# EAGLE design base01 (EAGLE 6.5.0)
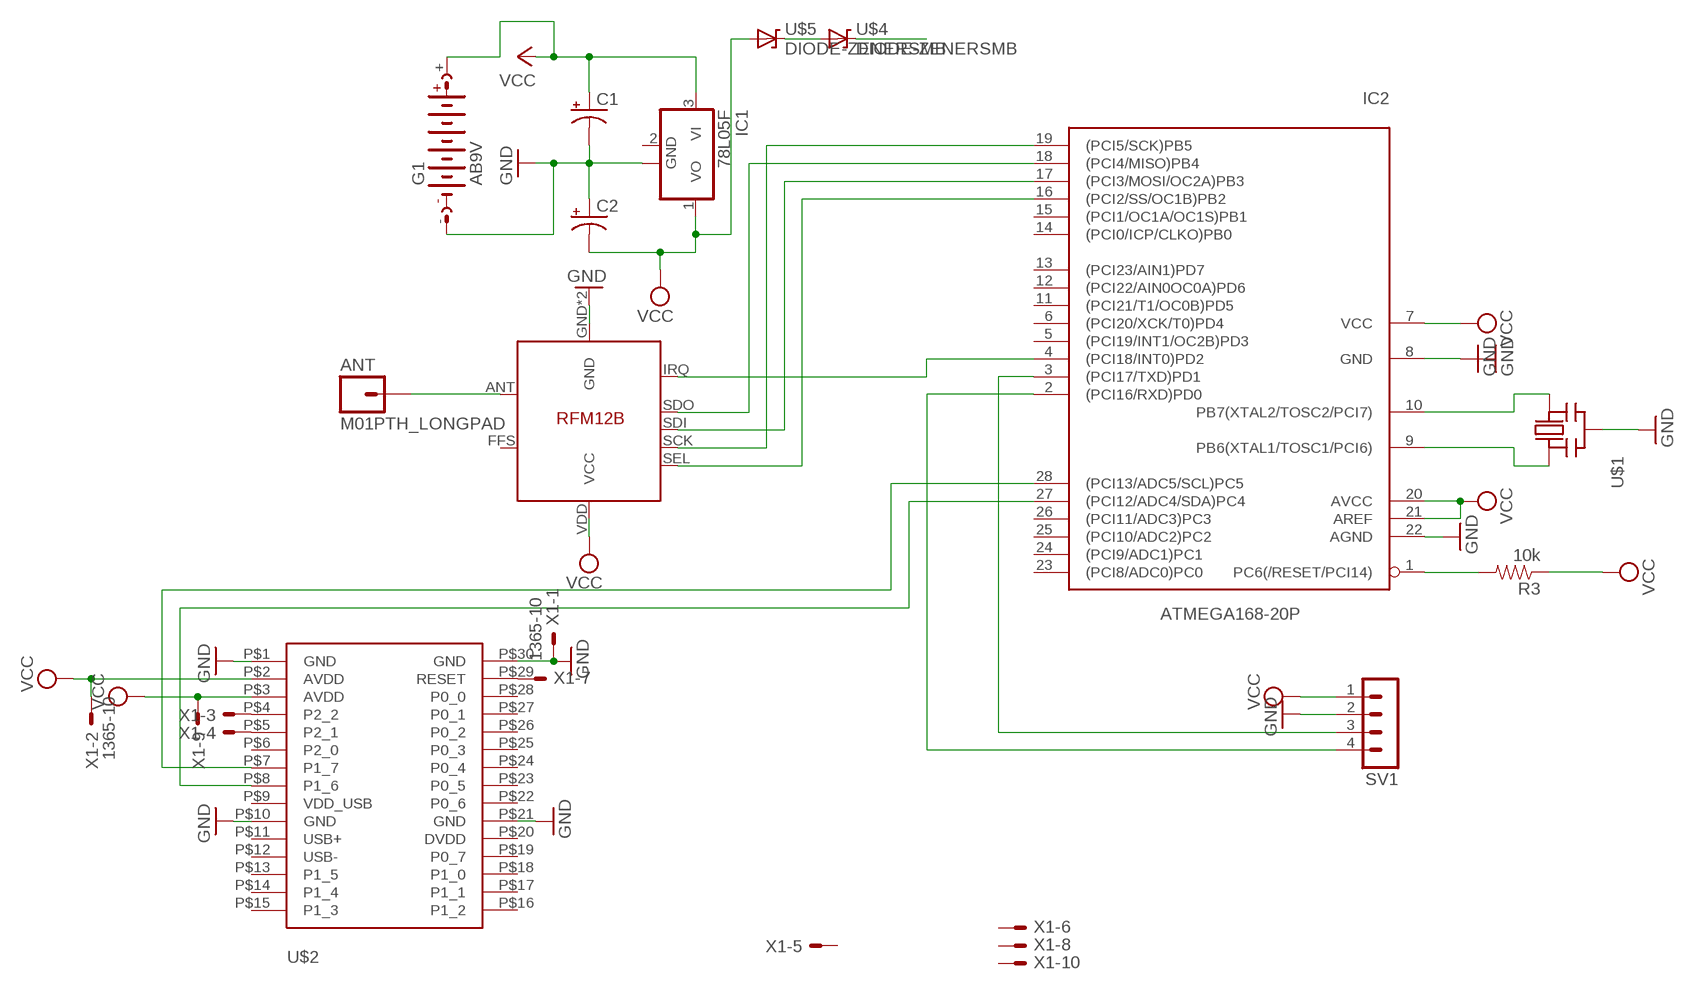
[diagram p0: schematic, sheet 1]

## Parts
ANT  M01PTH_LONGPAD  [1X01_LONGPAD]
C1  CAP_POLC  [PANASONIC_C]
C2  CAP_POLC  [PANASONIC_C]
G1  AB9V  [AB9V]
IC1  78L05F  [SOT89]
IC2  ATMEGA168-20P  [DIL28-3]
R3  10k  RESISTOR2512  [R2512]
SV1  MA04-1  [MA04-1]
U$1  CERMOSCILL-CSTCRG  [CSTCR-G]
U$2  BLE112  [BLE112]
U$3  RFM12BRMF12BGND  [RFM12B]
U$4  DIODE-ZENERSMB  [SMB-DIODE]
U$5  DIODE-ZENERSMB  [SMB-DIODE]
X1  1365-10  [1365-10]

## Nets
GND: C1.- C2.+ G1.- IC1.2@1(GND) IC2.8(GND) IC2.22(AGND) SV1.2 U$1.2(GND) U$2.P$1(GND) U$2.P$10(GND) U$2.P$21(GND) U$2.P$30(GND) U$3.GND U$3.P$12(GND) X1.1
N$1: IC2.28((PCI13/ADC5/SCL)PC5) U$2.P$7(P1_7)
N$2: IC2.9(PB6(XTAL1/TOSC1/PCI6)) U$1.1(IN)
N$3: IC2.4((PCI18/INT0)PD2) U$3.IRQ
N$4: IC2.16((PCI2/SS/OC1B)PB2) U$3.SEL
N$5: IC2.19((PCI5/SCK)PB5) U$3.SCK
N$6: IC2.17((PCI3/MOSI/OC2A)PB3) U$3.SDI
N$7: IC2.3((PCI17/TXD)PD1) SV1.3
N$8: IC2.27((PCI12/ADC4/SDA)PC4) U$2.P$8(P1_6)
N$9: U$2.P$29(RESET) X1.7
N$10: IC2.2((PCI16/RXD)PD0) SV1.4
N$11: U$2.P$4(P2_2) X1.3
N$12: U$2.P$5(P2_1) X1.4
N$13: IC2.10(PB7(XTAL2/TOSC2/PCI7)) U$1.3(OUT)
N$14: IC2.18((PCI4/MISO)PB4) U$3.SDO
N$15: U$4.A U$5.C
N$16: ANT.1 U$3.ANT
N$30: IC2.1(PC6(/RESET/PCI14)) R3.2
VCC: U$2.P$3(AVDD) X1.9
VCC3V: U$2.P$2(AVDD) U$4.C X1.2 ; supply symbol labelled VCC
VCC5V: C2.- IC1.1(VO) IC2.7(VCC) IC2.20(AVCC) IC2.21(AREF) R3.1 SV1.1 U$3.VDD(VCC) U$5.A ; supply symbol labelled VCC
VCCBAT: C1.+ G1.+ IC1.3(VI) ; supply symbol labelled VCC
Unconnected: IC1.2(GND) IC2.5((PCI19/INT1/OC2B)PD3) IC2.6((PCI20/XCK/T0)PD4) IC2.11((PCI21/T1/OC0B)PD5) IC2.12((PCI22/AIN0OC0A)PD6) IC2.13((PCI23/AIN1)PD7) IC2.14((PCI0/ICP/CLKO)PB0) IC2.15((PCI1/OC1A/OC1S)PB1) IC2.23((PCI8/ADC0)PC0) IC2.24((PCI9/ADC1)PC1) IC2.25((PCI10/ADC2)PC2) IC2.26((PCI11/ADC3)PC3) U$2.P$6(P2_0) U$2.P$9(VDD_USB) U$2.P$11(USB+) U$2.P$12(USB-) U$2.P$13(P1_5) U$2.P$14(P1_4) U$2.P$15(P1_3) U$2.P$16(P1_2) U$2.P$17(P1_1) U$2.P$18(P1_0) U$2.P$19(P0_7) U$2.P$20(DVDD) U$2.P$22(P0_6) U$2.P$23(P0_5) U$2.P$24(P0_4) U$2.P$25(P0_3) U$2.P$26(P0_2) U$2.P$27(P0_1) U$2.P$28(P0_0) U$3.FFS X1.5 X1.6 X1.8 X1.10

## Library data of the parts
ANT = SparkFun:M01: Header 1 Standard 1-pin 0.1" header. Use with straight break away headers (SKU : PRT-00116), right angle break away headers (PRT-00553), swiss pins (PRT-00743), machine pins (PRT-00117), and female headers (PRT-00115).
C1 C2 = SparkFun:CAP_POL: Capacitor Polarized These are standard SMD and PTH capacitors. Normally 10uF, 47uF, and 100uF in electrolytic and tantalum varieties. Always verify the external diameter of the through hole cap, it varies with capacity, voltage, and manufacturer. The EIA devices should be standard.
G1 = battery:AB9V: 9-V BATTERY CLIP
IC1 = linear:78L*: POSITOIV-VOLTAGE REGULATORS Output up to 100 mA Source: http://focus.ti.com/lit/ds/symlink/ua78l05.pdf
IC2 = adafruit:ATMEGA168*P: MICROCONTROLLER 16 kBytes FLASH 1 kBytes SRAM 512 Bytes EEPROM USART 8-channel 10 bit ADC
R3 = SparkFun:RESISTOR: Resistor Basic schematic elements and footprints for 0603, 1206, and PTH resistors.
SV1 = con-lstb:MA04-1: PIN HEADER; OC_FARNELL: unknown; OC_NEWARK: unknown
U$1 = adafruit:CERMOSCILL: Ceramic oscillator with built in capacitors such as ZTT-12MHz http://www.ladyada.net/library/eagle
U$2 = lightsuits:BLE112
U$3 = JeeParts:RFM12B: GND pins connected
U$4 U$5 = SparkFun:DIODE-ZENER: Zener Diode Production Part - 8199 3.4V Zener Voltage
X1 = con-leotronics:1365-10: DUAL ROW STRAIGHT HEADER 1364 SERIES. 1.27mm x 1.27mm. Without Fixing Post. SMT Source: http://www.leotronics.co.uk/Conexcon/Data%20Sheets/sec.%20A/1364ing.pdf; OC_FARNELL: unknown; OC_NEWARK: unknown

## Board
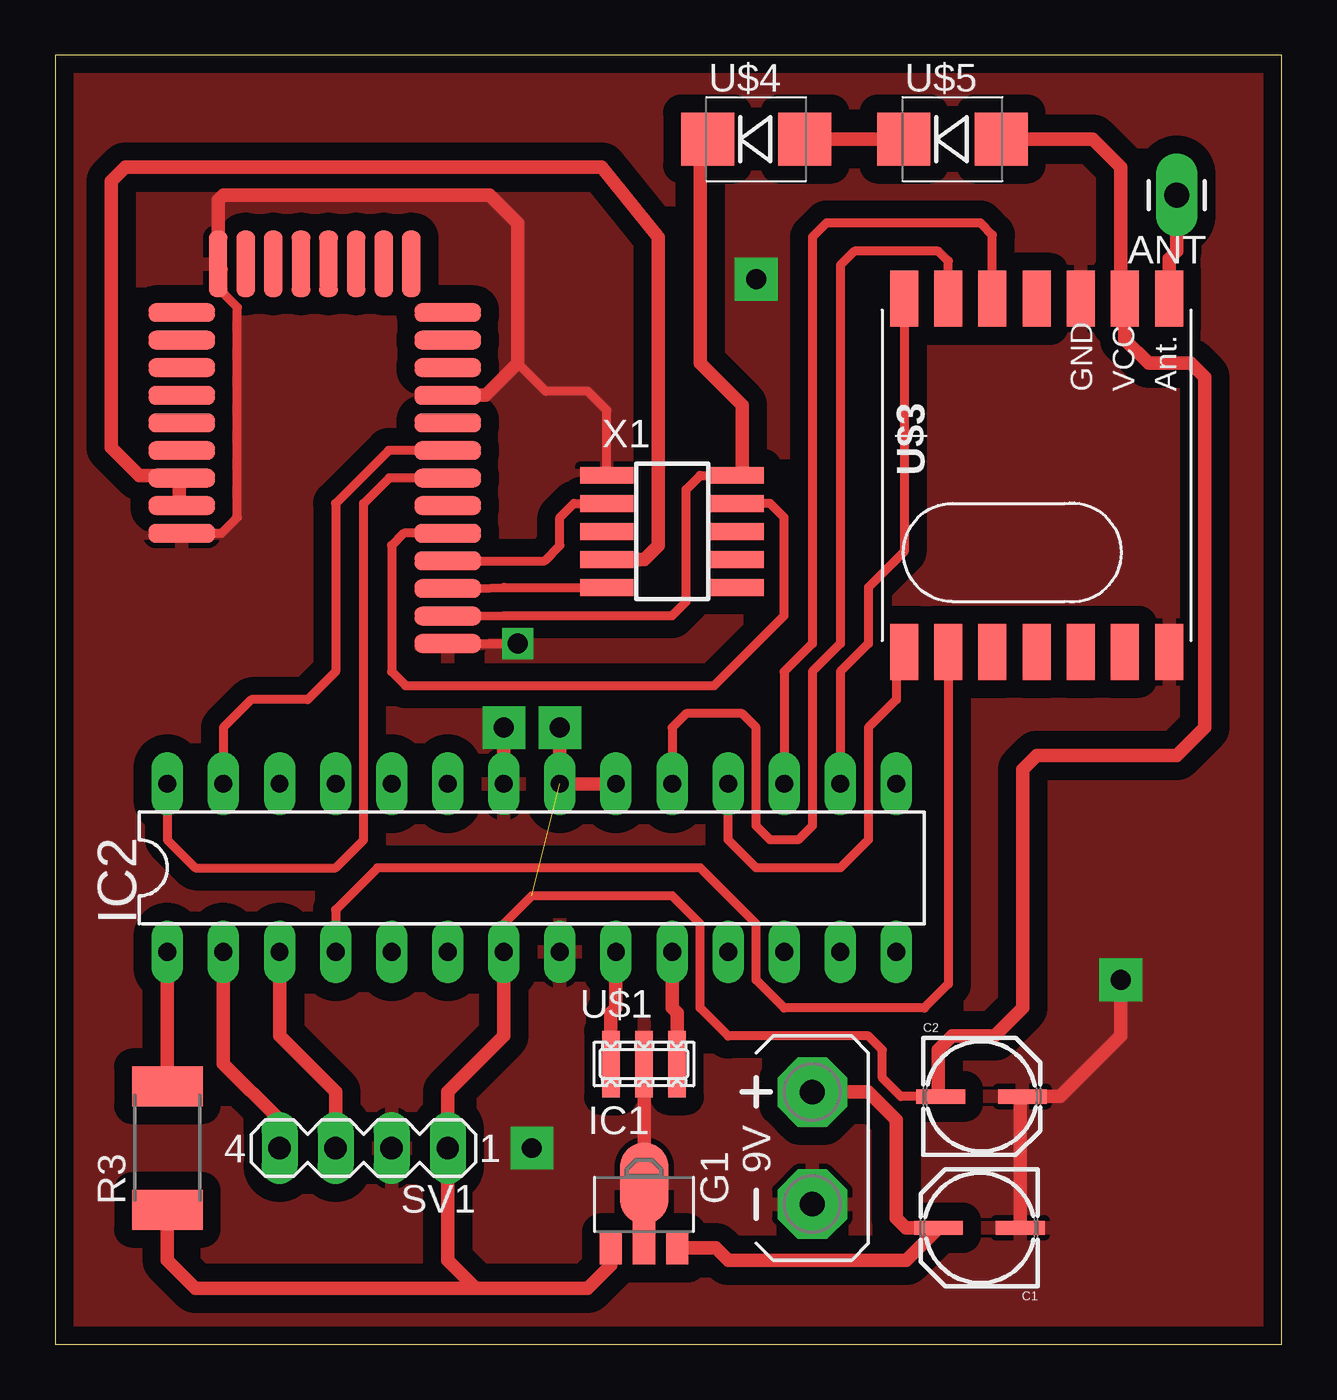
[diagram p1: board, top side]
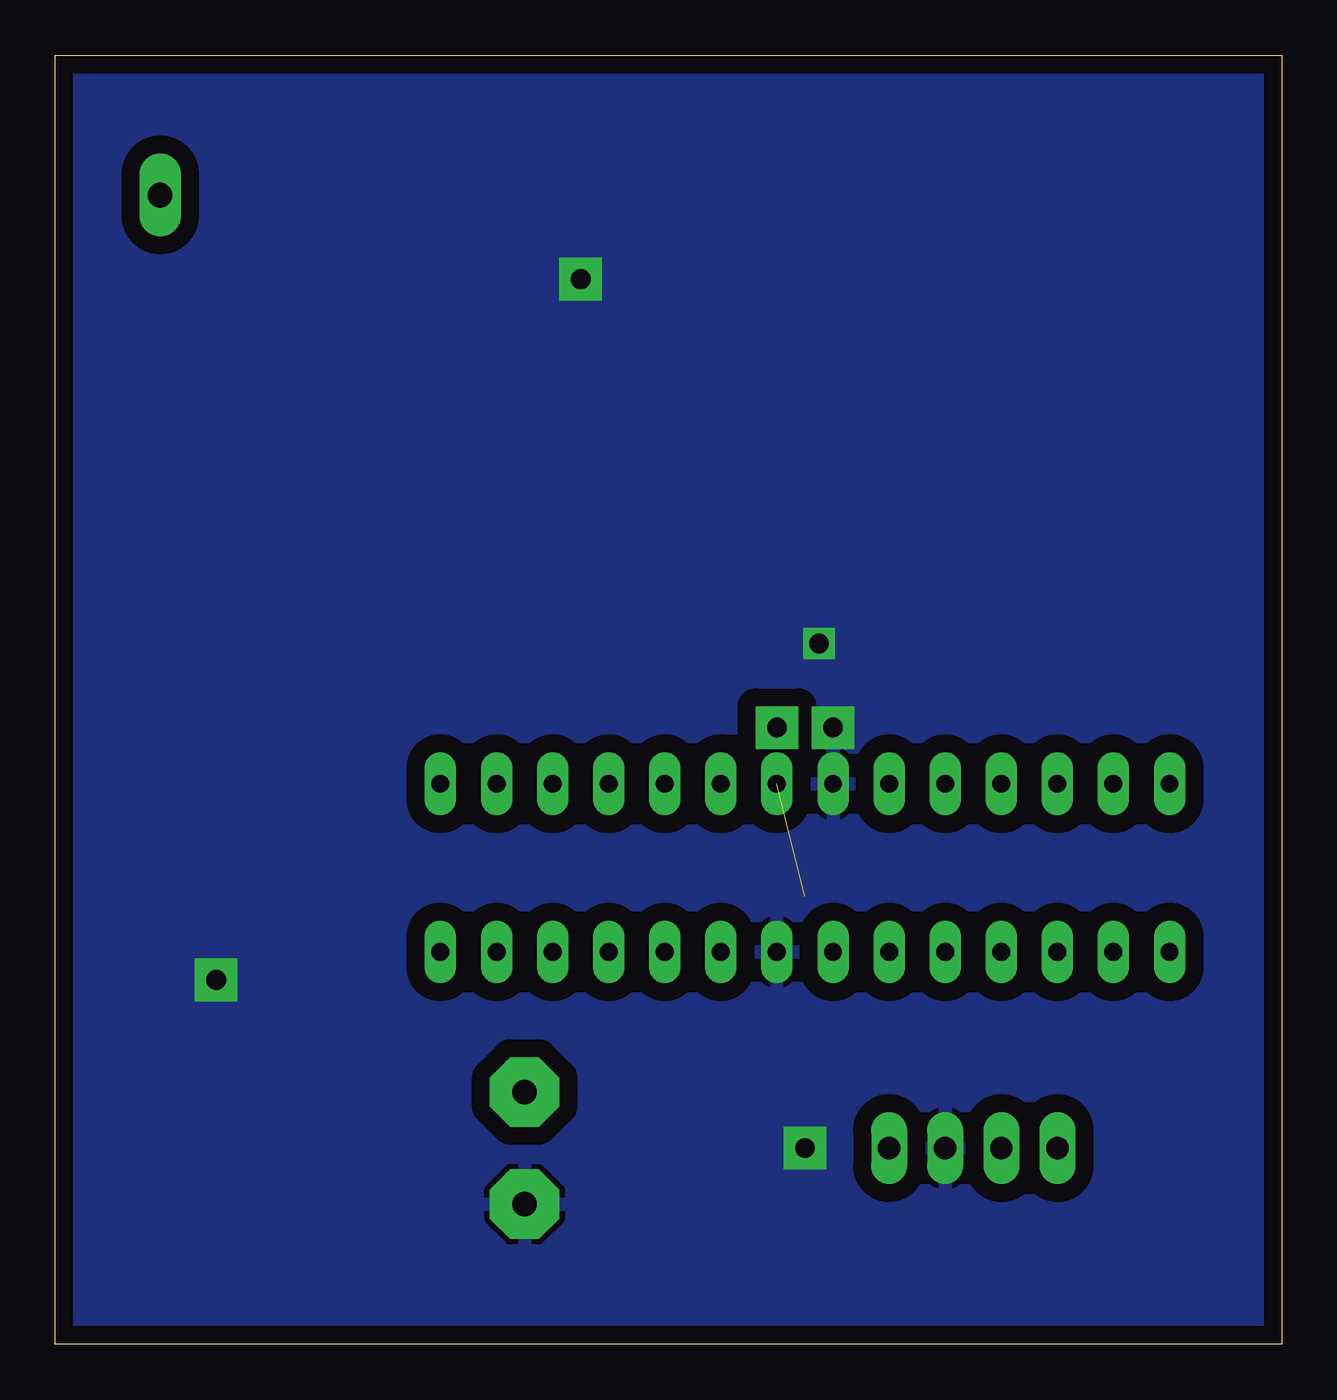
[diagram p2: board, bottom side, seen from below]

Size 55.55 x 58.41 mm. Coordinates in mm from the lower left corner, seen from the top.
Outline: 0,0 55.55,0 55.55,58.41 0,58.41 0,0
Copper layers (1*16): Top 0.035mm / dielectric 1.5mm / Bottom 0.035mm
Design rules "SparkFun": minimum track width 8mil, minimum drill 20mil, track to track 8mil, track to pad 8mil, pad to pad 8mil, via to via 8mil, smd to smd 8mil, copper to edge 10mil, drill to drill 8mil, minimum pad ring 12mil, minimum via ring 10mil, stop-mask expansion 4mil, vias tented up to drill 25mil, thermal gap 10mil

### Footprints (pad centres in the part's own frame; a part is rotated, then mirrored left to right if it is on the bottom)
1X01_LONGPAD = drill 1.118 pad 1.88 long: 1 0,0
PANASONIC_C = smd 2.2 x 0.65: + 1.9,-0.2; - -1.8,-0.2
AB9V = drill 1.118 pad 3.15 octagon: + 0,2.54; - 0,-2.54
SOT89 = smd 1 x 1.5: 1 -1.499,-1.981; 3 1.499,-1.981 | smd 1 x 2: 2 0,-1.727 | smd 2.2 x 3.7: 2@1 0,0.94
DIL28-3 = drill 0.813 long: 1 -16.51,-3.81; 2 -13.97,-3.81; 3 -11.43,-3.81; 4 -8.89,-3.81; 5 -6.35,-3.81; 6 -3.81,-3.81; 7 -1.27,-3.81; 8 1.27,-3.81; 9 3.81,-3.81; 10 6.35,-3.81; 11 8.89,-3.81; 12 11.43,-3.81; 13 13.97,-3.81; 14 16.51,-3.81; 15 16.51,3.81; 16 13.97,3.81; 17 11.43,3.81; 18 8.89,3.81; 19 6.35,3.81; 20 3.81,3.81; 21 1.27,3.81; 22 -1.27,3.81; 23 -3.81,3.81; 24 -6.35,3.81; 25 -8.89,3.81; 26 -11.43,3.81; 27 -13.97,3.81; 28 -16.51,3.81
R2512 = smd 1.8 x 3.2: 1 -2.8,0; 2 2.8,0
MA04-1 = drill 1.016 long: 1 -3.81,0; 2 -1.27,0; 3 1.27,0; 4 3.81,0
CSTCR-G = smd 0.8 x 3: 1 -1.5,0; 2 0,0; 3 1.5,0
BLE112 = smd 3 x 0.85: P$1 0,0; P$2 0,-1.25; P$3 0,-2.5; P$4 0,-3.75; P$5 0,-5; P$6 0,-6.25; P$7 0,-7.5; P$8 0,-8.75; P$9 0,-10; P$10 0,-11.25; P$11 0,-12.5; P$12 0,-13.75; P$13 0,-15; P$22 12.05,-15; P$23 12.05,-13.75; P$24 12.05,-12.5; P$25 12.05,-11.25; P$26 12.05,-10; P$27 12.05,-8.75; P$28 12.05,-7.5; P$29 12.05,-6.25; P$30 12.05,-5 | smd 0.85 x 3: P$14 1.65,-17.2; P$15 2.9,-17.2; P$16 4.15,-17.2; P$17 5.4,-17.2; P$18 6.65,-17.2; P$19 7.9,-17.2; P$20 9.15,-17.2; P$21 10.4,-17.2
RFM12B = smd 2.54 x 1.27: ANT 8,-6; FFS -8,2; GND 8,-2; IRQ -8,4; P$8 -8,0; P$9 -8,-2; P$10 -8,-4; P$12 -8,-6; P$16 8,0; SCK 8,4; SDI 8,2; SDO -8,6; SEL 8,6; VDD 8,-4
SMB-DIODE = smd 2.4 x 2.4: A 2.2,0; C -2.2,0
1365-10 = smd 0.76 x 2.4: 1 -2.54,-2.95; 2 -2.54,2.95; 3 -1.27,-2.95; 4 -1.27,2.95; 5 0,-2.95; 6 0,2.95; 7 1.27,-2.95; 8 1.27,2.95; 9 2.54,-2.95; 10 2.54,2.95

### Placement (x,y rotation side)
ANT  50.8,52.07 180 top
C1  41.91,5.08 180 top
C2  41.91,11.43 0 top
G1  34.29,8.89 0 top
IC1  26.67,6.35 0 top
IC2  21.59,21.59 0 top
R3  5.08,8.89 90 top
SV1  13.97,8.89 180 top
U$1  26.67,12.7 0 top
U$2  17.78,31.75 180 top
U$3  44.45,39.37 90 top
U$4  31.75,54.61 0 top
U$5  40.64,54.61 0 top
X1  27.94,36.83 270 top

### Tracks (layer width: path | path; a pad name or v marks a point on that pad's centre or on a via)
GND  (via drill 0.6, 0.9, 0.9 pad 1.93)
  Top 0.406: U$2.P$1 v20.95,31.75 | X1.1 24.99,42.32 24.13,43.18 22.23,43.18 20.95,44.45 | U$2.P$30 7.54,36.75 8.26,37.47 8.26,46.99 7.62,47.62 7.62,48.71 U$2.P$21
  Top 0.61: U$2.P$21 7.38,51.83 7.62,52.07 19.68,52.07 20.95,50.8 20.95,44.45 19.5,43 U$2.P$10 | IC2.22 v20.32,27.94 | C1.- 43.71,11.13 C2.+ 45.52,11.23 48.26,13.97 v48.26,16.51 | IC1.2@1 U$1.2
  other vias: 31.75,48.26 21.59,8.89
  pour Top (isolate 0.813): 0,0 0,58.42 55.88,58.42 55.88,0
  pour Bottom (isolate 0.813): 0,0 0,58.42 55.88,58.42 55.88,0
N$1
  Top 0.406: IC2.28 5.08,22.86 6.35,21.59 12.7,21.59 13.97,22.86 13.97,38.1 15.12,39.25 U$2.P$7
N$2
  Top 0.61: U$1.1 25.17,15.01 25.4,15.24 IC2.9
N$3
  Top 0.406: U$3.IRQ 40.45,16.32 39.37,15.24 33.02,15.24 31.75,16.51 31.75,19.05 29.21,21.59 14.61,21.59 12.7,19.68 IC2.4
N$4
  Top 0.406: U$3.SEL 38.45,35.91 36.83,34.29 36.83,31.75 35.56,30.48 IC2.16
N$5
  Top 0.406: U$3.SCK 40.45,49.09 40.01,49.53 36.2,49.53 35.56,48.9 35.56,31.75 34.29,30.48 34.29,23.5 33.66,22.86 32.38,22.86 31.75,23.5 31.75,27.94 31.11,28.57 28.57,28.57 27.94,27.94 IC2.19
N$6
  Top 0.406: 42.8,47.37 U$3.SDI 42.45,50.26 41.91,50.8 34.92,50.8 34.29,50.17 34.29,31.75 33.02,30.48 IC2.17
N$7
  Top 0.61: SV1.3 12.7,11.43 10.16,13.97 IC2.3
N$8
  Top 0.406: U$2.P$8 15.1,40.5 12.7,38.1 12.7,30.48 11.43,29.21 8.89,29.21 7.62,27.94 IC2.27
N$9
  Top 0.406: 5.63,38.1 U$2.P$29
  Top 0.61: X1.7 26.67,35.56 27.3,36.2 27.3,50.17 24.77,53.34 3.17,53.34 2.54,52.71 2.54,40.64 3.81,39.37 5.63,39.37 5.63,38.1
N$10
  Top 0.61: SV1.4 10.16,10.16 7.62,12.7 IC2.2
N$11
  Top 0.406: U$2.P$4 22.16,35.5 22.86,36.2 22.86,37.47 23.5,38.1 X1.3
N$12
  Top 0.406: U$2.P$5 15.79,36.75 15.24,36.2 15.24,30.48 15.88,29.84 29.84,29.84 33.02,33.02 33.02,37.47 32.38,38.1 X1.4
N$13
  Top 0.61: U$1.3 28.17,15.01 27.94,15.24 IC2.10
N$14
  Top 0.406: U$3.SDO 38.45,31.4 38.1,31.75 38.1,29.21 36.83,27.94 36.83,22.86 35.56,21.59 31.75,21.59 30.48,22.86 IC2.18
N$15
  Top 0.61: U$4.A U$5.C
N$16
  Top 0.61: U$3.ANT 50.45,49.18 50.8,49.53 ANT.1
N$30
  Top 0.61: R3.2 IC2.1
VCC
  Top 0.406: U$2.P$3 19.09,34.25 20.32,34.29 X1.9
VCC3V
  Top 0.406: U$2.P$2 19.07,33 20.32,33.02 27.94,33.02 28.57,33.66 28.57,38.74 29.21,39.37 X1.2
  Top 0.61: U$4.C 29.21,54.61 29.21,44.45 31.11,42.55 31.11,39.6 X1.2
VCC5V  (via drill 0.9 pad 1.93)  (1 unrouted)
  Top 0.406: IC1.1 25.17,3.58 | IC2.7 20.32,19.05 21.59,20.32 27.94,20.32 29.21,19.05 29.21,15.24 30.48,13.97 36.83,13.97 37.47,13.33 37.47,12.06 38.3,11.23 C2.- 40.01,11.33
  Top 0.61: IC2.7 20.32,13.97 17.78,11.43 SV1.1 17.78,3.81 19.05,2.54 | 25.17,3.58 24.13,2.54 19.05,2.54 | R3.1 5.08,3.81 6.35,2.54 19.05,2.54 | 40.01,11.33 40.01,13.33 40.64,13.97 42.55,13.97 43.81,15.24 43.81,26.04 44.45,26.67 50.8,26.67 52.07,27.94 52.07,43.82 51.44,44.45 49.53,44.45 48.45,45.53 U$3.VDD 48.26,47.56 48.26,53.34 46.99,54.61 U$5.A | IC2.20 IC2.21 v22.86,27.94
VCCBAT
  Top 0.61: G1.+ 36.83,11.43 38.1,10.16 38.1,5.71 38.53,5.28 C1.+ 38.54,3.81 30.48,3.81 29.92,4.37 IC1.3